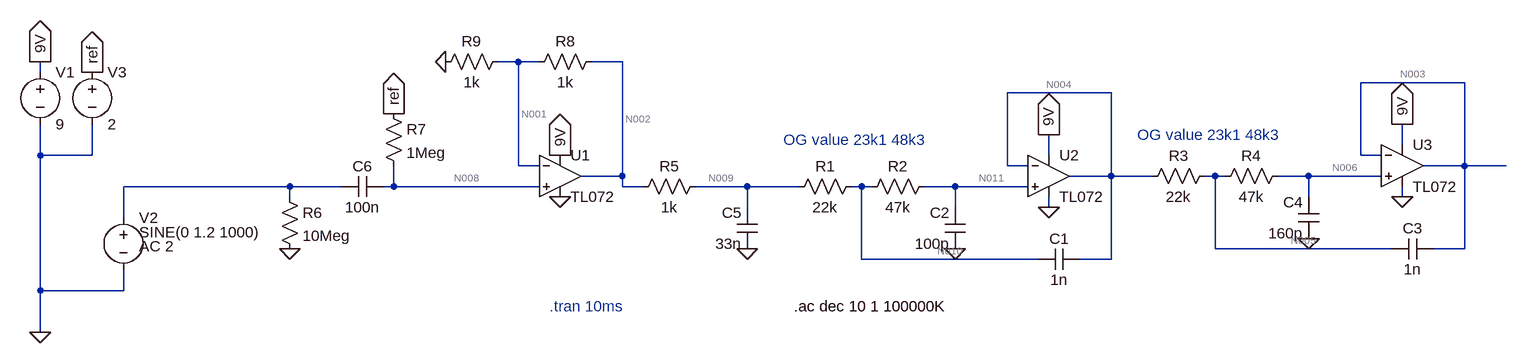
[diagram p0: schematic Butterworth_input_filter.asc]
* Butterworth_input_filter.asc
V1 9V 0 9
V2 N007 0 SINE(0 1.2 1000) AC 2
R1 N010 N009 22k
R2 N011 N010 47k
C1 N004 N010 1n
C2 0 N011 100p
R3 N005 N004 22k
R4 N006 N005 47k
C3 N003 N005 1n
C4 0 N006 160p
C5 0 N009 33n
R5 N009 N002 1k
V3 ref 0 2
R6 N007 0 10Meg
C6 N008 N007 100n
R7 ref N008 1Meg
R8 N002 N001 1k
R9 N001 0 1k
* U1: TL072 (symbol TL072 not available, pins judged from their places): In+=N008 In-=N001 V+=9V V-=0 OUT=N002
* U2: TL072 (symbol TL072 not available, pins judged from their places): In+=N011 In-=N004 V+=9V V-=0 OUT=N004
* U3: TL072 (symbol TL072 not available, pins judged from their places): In+=N006 In-=N003 V+=9V V-=0 OUT=N003
.ac dec 10 1 100000K
* OG value 23k1 48k3
* OG value 23k1 48k3
* .tran 10ms
.backanno
.end

* Results of the author's LTspice run, read from the files saved beside the schematic
* Operating Point, zero values left out:
*   V(9v) = 9 V
*   V(n010) = 4 V
*   V(n009) = 4 V
*   V(n011) = 4 V
*   V(n004) = 4 V
*   V(n005) = 4 V
*   V(n006) = 4 V
*   V(n003) = 4 V
*   V(n002) = 4 V
*   V(ref) = 2 V
*   V(n008) = 2 V
*   V(n001) = 2 V
*   I(R1) = -34.05 pA
*   I(R2) = -34.05 pA
*   I(R3) = -34.05 pA
*   I(R4) = -34.05 pA
*   I(R5) = -34.05 pA
*   I(R7) = 32.04 pA
*   I(R8) = 2 mA
*   I(R9) = 2 mA
*   I(V1) = -13.18 mA
*   I(V3) = -32.04 pA
*   Ix(u1:1) = 32.04 pA
*   Ix(u1:2) = 32.05 pA
*   Ix(u1:3) = 4.395 mA
*   Ix(u1:4) = -4.398 mA
*   Ix(u1:5) = -2 mA
*   Ix(u2:1) = 34.05 pA
*   Ix(u2:2) = 34.05 pA
*   Ix(u2:3) = 4.395 mA
*   Ix(u2:4) = -4.396 mA
*   Ix(u2:5) = -68.1 pA
*   Ix(u3:1) = 34.05 pA
*   Ix(u3:2) = 34.05 pA
*   Ix(u3:3) = 4.395 mA
*   Ix(u3:4) = -4.396 mA
*   Ix(u3:5) = -34.05 pA
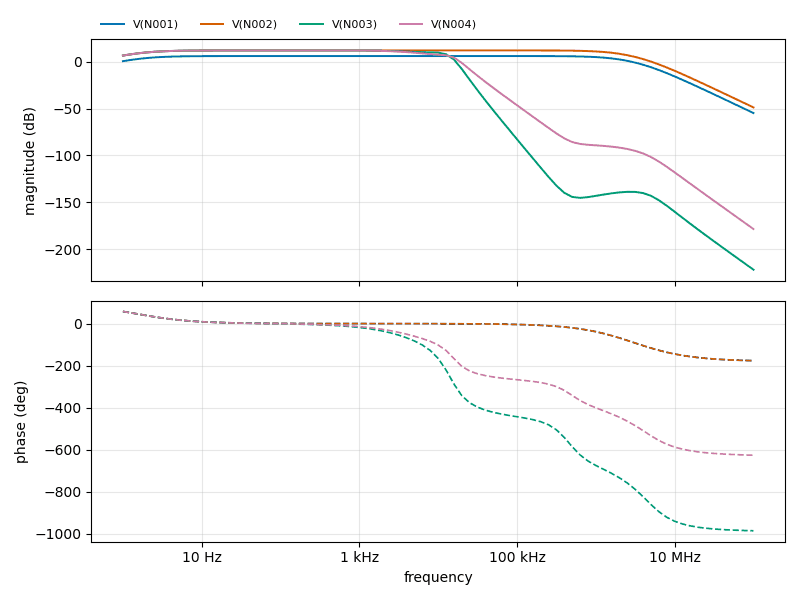
[diagram p1: AC Analysis of Butterworth_input_filter.asc, plotted from the saved traces]
* AC Analysis, 1 run:
*   V(N001): 0.54 dB at 1 Hz, -54.80 dB at 100 MHz, peak 6.02 dB at 15.85 kHz, 3 dB below the peak at 1.594 Hz and 1.759 MHz
*   V(N002): 6.56 dB at 1 Hz, -48.78 dB at 100 MHz, peak 12.04 dB at 15.85 kHz, 3 dB below the peak at 1.594 Hz and 1.759 MHz
*   V(N003): 6.56 dB at 1 Hz, -221.96 dB at 100 MHz, peak 12.04 dB at 100 Hz, 3 dB below the peak at 1.591 Hz and 10.93 kHz
*   V(N004): 6.56 dB at 1 Hz, -178.57 dB at 100 MHz, peak 12.04 dB at 100 Hz, 3 dB below the peak at 1.591 Hz and 5.913 kHz